# Altium schematic sheet MCU.SchDoc: C2Sv1 Schematic
size A4; Author: Felix Abbott; CompanyName: PAST; SheetNumber: 2; SheetTotal: 5
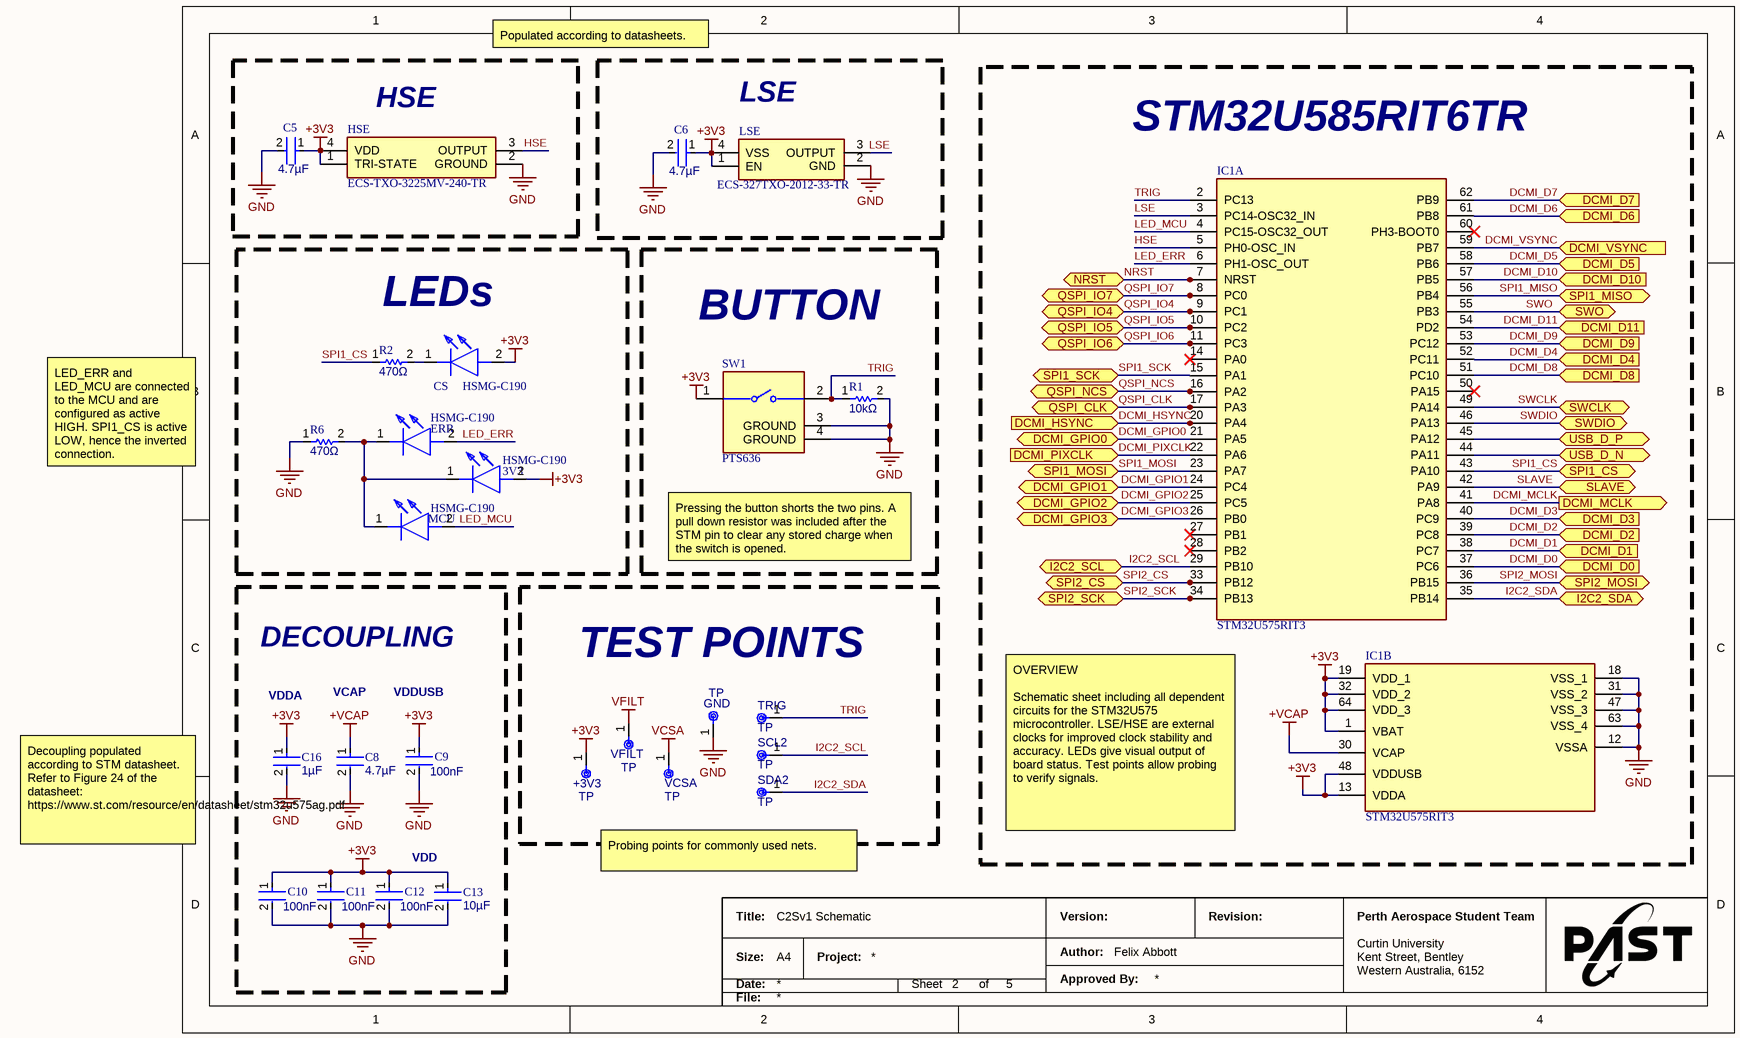
[diagram p0: MCU.SchDoc]

## Parts
3V3  HSMG-C190  [LEDC1608X90N]
+3V3  TP  [TP06R]  (no BOM)
C5  value 4.7µF  [FP-GRT188-0_2-IPC_B]  (hidden comment: GRT188C81E475KE13J)
C6  value 4.7µF  [FP-GRT188-0_2-IPC_B]  (hidden comment: GRT188C81E475KE13J)
C8  value 4.7µF  [FP-GRT188-0_2-IPC_B]  (hidden comment: GRT188C81E475KE13J)
C9  value 100nF  [FP-GCM188-0_1-IPC_B]  (hidden comment: GCM188L81H104MA57D)
C10  value 100nF  [FP-GCM188-0_1-IPC_B]  (hidden comment: GCM188L81H104MA57D)
C11  value 100nF  [FP-GCM188-0_1-IPC_B]  (hidden comment: GCM188L81H104MA57D)
C12  value 100nF  [FP-GCM188-0_1-IPC_B]  (hidden comment: GCM188L81H104MA57D)
C13  value 10µF  [FP-GCM188-0_2-IPC_B]  (hidden comment: GCM188D70J106ME36D)
C16  value 1µF  [FP-GCM188-0_1-IPC_B]  (hidden comment: GCM188R71C105KA64J)
CS  HSMG-C190  [LEDC1608X90N]
ERR  HSMG-C190  [LEDC1608X90N]
GND  TP  [TP06R]  (no BOM)
HSE  ECS-TXO-3225MV-240-TR  [ECSTXO3225MV240TR]
IC1  STM32U575RIT3  [QFP50P1200X1200X160-64N]  (parts A,B of 2)
LSE  ECS-327TXO-2012-33-TR  [ECS327TXO201233TR]
MCU  HSMG-C190  [LEDC1608X90N]
R1  value 10kΩ  [FP-CRCW0603-e3-IPC_C]  (hidden comment: CRCW060310K0FKED)
R2  value 470Ω  [FP-CRCW0603-e3-IPC_C]  (hidden comment: CRCW0603470RFKEC)
R6  value 470Ω  [FP-CRCW0603-e3-IPC_C]  (hidden comment: CRCW0603470RFKEC)
SCL2  TP  [TP06R]  (no BOM)
SDA2  TP  [TP06R]  (no BOM)
SW1  PTS636  [FP-PTS636_SKG25_SMTR_LFS-MFG]
TRIG  TP  [TP06R]  (no BOM)
VCSA  TP  [TP06R]  (no BOM)
VFILT  TP  [TP06R]  (no BOM)

## Blocks framed on the sheet
HSE: C5 HSE
LSE: C6 LSE
STM32U585RIT6TR: IC1
LEDs: 3V3 CS ERR MCU R2 R6
BUTTON: R1 SW1
DECOUPLING: C8-C13 C16
TEST POINTS: +3V3 GND SCL2 SDA2 TRIG VCSA VFILT

## Ports
DCMI_D0 (in), DCMI_D1 (in), DCMI_D2 (in), DCMI_D3 (in), DCMI_D4 (in), DCMI_D5 (in), DCMI_D6 (in), DCMI_D7 (in), DCMI_D8 (in), DCMI_D9 (in), DCMI_D10 (in), DCMI_D11 (in), DCMI_GPIO0 (bidir), DCMI_GPIO1 (bidir), DCMI_GPIO2 (bidir), DCMI_GPIO3 (bidir), DCMI_HSYNC (in), DCMI_MCLK (out), DCMI_PIXCLK (in), DCMI_VSYNC (in), I2C2_SCL (bidir), I2C2_SDA (bidir), NRST (bidir), QSPI_CLK (bidir), QSPI_IO4 (bidir), QSPI_IO5 (bidir), QSPI_IO6 (bidir), QSPI_IO7 (bidir), QSPI_NCS (bidir), SLAVE (bidir), SPI1_CS (bidir), SPI1_MISO (bidir), SPI1_MOSI (bidir), SPI1_SCK (bidir), SPI2_CS (bidir), SPI2_MOSI (bidir), SPI2_SCK (bidir), SWCLK (bidir), SWDIO (bidir), SWO (bidir), USB_D_N (bidir), USB_D_P (bidir)

## Nets
+3V3: 3V3.2(A) +3V3.1(TP) C5.1 C6.1 C9.1 C10.1 C11.1 C12.1 C13.1 C16.1 CS.2(A) HSE.1(TRI-STATE) HSE.4(VDD) IC1.1(VBAT) IC1.13(VDDA) IC1.19(VDD_1) IC1.32(VDD_2) IC1.48(VDDUSB) IC1.64(VDD_3) LSE.1(EN) LSE.4(VSS) SW1.1
+VCAP: C8.1 IC1.30(VCAP)
GND: C5.2 C6.2 C8.2 C9.2 C10.2 C11.2 C12.2 C13.2 C16.2 GND.1(TP) HSE.2(GROUND) IC1.12(VSSA) IC1.18(VSS_1) IC1.31(VSS_2) IC1.47(VSS_3) IC1.63(VSS_4) LSE.2(GND) R1.2 R6.1 SW1.3(GROUND) SW1.4(GROUND)
VCSA: VCSA.1(TP)
VFILT: VFILT.1(TP)
DCMI_D0: IC1.37(PC6) ; port DCMI_D0
DCMI_D1: IC1.38(PC7) ; port DCMI_D1
DCMI_D2: IC1.39(PC8) ; port DCMI_D2
DCMI_D3: IC1.40(PC9) ; port DCMI_D3
DCMI_D4: IC1.52(PC11) ; port DCMI_D4
DCMI_D5: IC1.58(PB6) ; port DCMI_D5
DCMI_D6: IC1.61(PB8) ; port DCMI_D6
DCMI_D7: IC1.62(PB9) ; port DCMI_D7
DCMI_D8: IC1.51(PC10) ; port DCMI_D8
DCMI_D9: IC1.53(PC12) ; port DCMI_D9
DCMI_D10: IC1.57(PB5) ; port DCMI_D10
DCMI_D11: IC1.54(PD2) ; port DCMI_D11
DCMI_GPIO0: IC1.21(PA5) ; port DCMI_GPIO0
DCMI_GPIO1: IC1.24(PC4) ; port DCMI_GPIO1
DCMI_GPIO2: IC1.25(PC5) ; port DCMI_GPIO2
DCMI_GPIO3: IC1.26(PB0) ; port DCMI_GPIO3
DCMI_HSYNC: IC1.20(PA4) ; port DCMI_HSYNC
DCMI_MCLK: IC1.41(PA8) ; port DCMI_MCLK
DCMI_PIXCLK: IC1.22(PA6) ; port DCMI_PIXCLK
DCMI_VSYNC: IC1.59(PB7) ; port DCMI_VSYNC
HSE: HSE.3(OUTPUT) IC1.5(PH0-OSC_IN)
I2C2_SCL: IC1.29(PB10) SCL2.1(TP) ; port I2C2_SCL
I2C2_SDA: IC1.35(PB14) SDA2.1(TP) ; port I2C2_SDA
LED_ERR: ERR.2(A) IC1.6(PH1-OSC_OUT)
LED_MCU: IC1.4(PC15-OSC32_OUT) MCU.2(A)
LSE: IC1.3(PC14-OSC32_IN) LSE.3(OUTPUT)
NRST: IC1.7(NRST) ; port NRST
QSPI_CLK: IC1.17(PA3) ; port QSPI_CLK
QSPI_IO4: IC1.9(PC1) ; port QSPI_IO4
QSPI_IO5: IC1.10(PC2) ; port QSPI_IO5
QSPI_IO6: IC1.11(PC3) ; port QSPI_IO6
QSPI_IO7: IC1.8(PC0) ; port QSPI_IO7
QSPI_NCS: IC1.16(PA2) ; port QSPI_NCS
SLAVE: IC1.42(PA9) ; port SLAVE
SPI1_CS: IC1.43(PA10) R2.1 ; port SPI1_CS
SPI1_MISO: IC1.56(PB4) ; port SPI1_MISO
SPI1_MOSI: IC1.23(PA7) ; port SPI1_MOSI
SPI1_SCK: IC1.15(PA1) ; port SPI1_SCK
SPI2_CS: IC1.33(PB12) ; port SPI2_CS
SPI2_MOSI: IC1.36(PB15) ; port SPI2_MOSI
SPI2_SCK: IC1.34(PB13) ; port SPI2_SCK
SWCLK: IC1.49(PA14) ; port SWCLK
SWDIO: IC1.46(PA13) ; port SWDIO
SWO: IC1.55(PB3) ; port SWO
TRIG: IC1.2(PC13) R1.1 SW1.2 TRIG.1(TP)
USB_D_N: IC1.44(PA11) ; port USB_D_N
USB_D_P: IC1.45(PA12) ; port USB_D_P
Net3V3_1: 3V3.1(K) ERR.1(K) MCU.1(K) R6.2
NetCS_1: CS.1(K) R2.2

Not connected (* = marked no-connect by the designer): IC1 14(PA0)* 27(PB1)* 28(PB2)* 50(PA15)* 60(PH3-BOOT0)*

## Notes on the sheet
- Populated according to datasheets.
- LED_ERR and LED_MCU are connected to the MCU and are configured as active HIGH. SPI1_CS is active LOW, hence the inverted connection.
- (near SW1) Pressing the button shorts the two pins. A pull down resistor was included after the STM pin to clear any stored charge when the switch is opened.
- VDDA
- VCAP
- VDDUSB
- Decoupling populated according to STM datasheet. Refer to Figure 24 of the datasheet: https://www.st.com/resource/en/datasheet/stm32u575ag.pdf
- VDD
- OVERVIEW
  Schematic sheet including all dependent circuits for the STM32U575 microcontroller. LSE/HSE are external clocks for improved clock stability and accuracy. LEDs give visual output of board status. Test points allow probing to verify signals.
- (near SDA2) Probing points for commonly used nets.
- Title:
- Version:
- Revision:
- Perth Aerospace Student Team
- Size:
- Date:
- A4
- Project:
- Sheet
- of
- Author:
- Approved By:
- Curtin University
- Kent Street, Bentley
- Western Australia, 6152
- File:

## Library data of the parts
3V3 CS ERR MCU = CMP-062-000014-1: LED; Manufacturer_Name: Avago Technologies; Mouser Part Number: 630-HSMG-C190; Manufacturer_Part_Number: HSMG-C190; Mouser Price/Stock: https://www.mouser.co.uk/ProductDetail/Broadcom-Avago/HSMG-C190?qs=YDL0qNrpDT605sxOaps8VQ%3D%3D; Datasheet Link: https://docs.broadcom.com/docs/AV02-0551EN; Source: SamacSys.SchLib; Design Item ID: HSMG-C190; Height: 0.9mm
+3V3 GND SCL2 SDA2 TRIG VCSA VFILT = CMP-00028-00007-4: test point; Pins: 1; Author: Raphael Ho
C5 C6 C8 = CMP-001-00100-1: Ceramic Capacitor, Multilayer, Ceramic, 25V, 10% +Tol, 10% -Tol, X6S, 22% TC, 4.7uF, Surface Mount, 1608M/0603; Manufacturer Lifecycle Status: IN PRODUCTION; Added By: Felix; Width: 800µm; Material: Ceramic; Number of Terminals: 2; Introduction Date: 2016-01-27; Max Operating Temperature: 105°C; Export Control Classification Number (ECCN) Code: EAR99; Dielectric Material: Ceramic; REACH SVHC: Yes; Case/Package: 0603; Harmonized Tariff Schedule (HTS) Code: 8532.24.00.20; Min Operating Temperature: -55°C; Height: 800µm; RoHS: Compliant; Mounting Technology: Surface Mount; Voltage Rating: 25V; Thickness: 800µm; Tolerance: 10%; Lifecycle Status: Production; Voltage Rating (DC): 25V; Length: 1.6mm
C9-C12 = CMP-001-00108-1: Cap Ceramic 0.1uF 50V X8L 20% Pad SMD 0603 150C Automotive T/R; Manufacturer Lifecycle Status: IN PRODUCTION; Added By: Felix; Country of Origin: Philippines; Number of Terminals: 2; Max Operating Temperature: 150°C; Tolerance: 20%; Harmonized Tariff Schedule (HTS) Code: 8532.24.00.20; Length: 1.6mm; Thickness: 800µm; Export Control Classification Number (ECCN) Code: EAR99; Voltage Rating (DC): 50V; Mounting Technology: Surface Mount; Dielectric Material: Ceramic; Height: 800µm; Lifecycle Status: Production; Material: Ceramic; Introduction Date: 2013-11-20; Voltage Rating: 50V; Width: 800µm; RoHS: Compliant; REACH SVHC: Yes; Min Operating Temperature: -55°C; Case/Package: 0603
C13 = CMP-001-00109-1: 6.3V 10uF X7T ±20% 0603 Multilayer Ceramic Capacitors MLCC - SMD/SMT ROHS; Manufacturer Lifecycle Status: IN PRODUCTION; Added By: Felix; Thickness: 800µm; REACH SVHC: Yes; Voltage Rating (DC): 6.3V; Number of Terminals: 2; Dielectric Material: Ceramic; Lifecycle Status: Production; Harmonized Tariff Schedule (HTS) Code: 8532.24.00.20; Case/Package: 0603; Introduction Date: 2020-01-27; Schedule B: 8532240020; Mounting Technology: Surface Mount; Voltage Rating: 6.3V; Export Control Classification Number (ECCN) Code: EAR99; Min Operating Temperature: -55°C; RoHS: Compliant; Material: Ceramic; Width: 800µm; Max Operating Temperature: 125°C; Height: 800µm; Length: 1.6mm; Tolerance: 20%
C16 = CMP-001-00107-1: 16V 1uF X7R ±10% 0603 Multilayer Ceramic Capacitors MLCC - SMD/SMT ROHS; Manufacturer Lifecycle Status: IN PRODUCTION; Added By: Felix; Tolerance: 10%; Max Operating Temperature: 125°C; Case Code (Imperial): 0603; Height: 800µm; Export Control Classification Number (ECCN) Code: EAR99; Voltage Rating (DC): 16V; Depth: 800µm; Case/Package: 0603; Case Code (Metric): 1608; Ratings: AEC-Q200; Mounting Technology: Surface Mount; Lifecycle Status: Production; RoHS: Compliant; Length: 1.6mm; Introduction Date: 2010-10-29; Radiation Hardening: No; Min Operating Temperature: -55°C; Packaging: Tape & Reel (TR); Lead Free: Lead Free; Voltage Rating: 16V; Material: Ceramic; Country of Origin: Philippines; Dielectric Material: Ceramic; REACH SVHC: Yes; Width: 800µm; Harmonized Tariff Schedule (HTS) Code: 8532.24.00.20; Number of Terminals: 2; Schedule B: 8532240020, 8532240020; Dielectric: X7R
HSE = CMP-179-000000-2: Crystal or Oscillator; Manufacturer_Name: ECS; Source: C2Sv0.1.SchLib; Mouser Price/Stock: https://www.mouser.co.uk/ProductDetail/ECS/ECS-TXO-3225MV-240-TR?qs=d0WKAl%252BL4KYXn7UuwSFJGQ%3D%3D; Height: 1.2mm; Datasheet Link: https://eu.mouser.com/datasheet/2/122/ECS-TXO-3225MV-1634330.pdf; Mouser Part Number: 520-TXO-3225MV-240-T; Design Item ID: ECS-TXO-3225MV-240-TR; Manufacturer_Part_Number: ECS-TXO-3225MV-240-TR; Imported By: Felix
IC1 = CMP-209-000002-2: Ultra-low-power Arm Cortex-M33 32-bit MCU+TrustZone+FPU; Manufacturer_Name: STMicroelectronics; Added By: Felix Abbott; Manufacturer_Part_Number: STM32U575RIT3; Source: Schlib1.SchLib; Height: 1.6mm; Datasheet Link: https://www.st.com/resource/en/datasheet/stm32u575ag.pdf; Design Item ID: STM32U575RIT3
LSE = CMP-190-000000-2: Crystal or Oscillator; Manufacturer_Name: ECS; Added By: Felix; Mouser Price/Stock: https://www.mouser.co.uk/ProductDetail/ECS/ECS-327TXO-2012-33-TR?qs=amGC7iS6iy%252Bnhf6zW2Y7hQ%3D%3D; Height: 1.2mm; Datasheet Link: https://ecsxtal.com/store/pdf/ECS-327TXO-2012.pdf; Manufacturer_Part_Number: ECS-327TXO-2012-33-TR; Mouser Part Number: 520-327TXO-2012-33TR; Source: Schematic Library.SchLib; Design Item ID: ECS-327TXO-2012-33-TR
R1 = CMP-009-00205-3: Resistor; Temperature Coefficient: 100ppm/°C; Working Voltage: 75V; Power Dissipation: 100mW; Added By: Felix; Tolerance: 1%; Max Operating Temperature: 155°C; Width: 850µm; Composition: Thick Film; Mounting Technology: Surface Mount; Number of Terminations: 2; Height: 450µm; Number of Terminals: 2; RoHS: Compliant; Power Rating: 100mW; Harmonized Tariff Schedule (HTS) Code: 8533.21.00.30; Case/Package: 0603; Export Control Classification Number (ECCN) Code: EAR99; Introduction Date: 2003-05-01; REACH SVHC: Yes; Lead Free: Lead Free; Features: Automotive AEC-Q200; Min Operating Temperature: -55°C; Voltage Rating: 75V; Country of Origin: Israel, Taiwan; Lifecycle Status: Production; Max Power Dissipation: 100mW; Length: 1.55mm; Packaging: Tape & Reel (TR); China RoHS: Non-Compliant
R2 R6 = CMP-009-00206-1: Resistor; Power Dissipation: 100mW; Voltage Rating: 75V; Tolerance: 1%; Added By: Felix; Temperature Coefficient: 100ppm/°C; China RoHS: Non-Compliant; Mounting Technology: Surface Mount; Export Control Classification Number (ECCN) Code: EAR99; Depth: 850µm; Number of Terminals: 2; REACH SVHC: Yes; Case/Package: 0603; Harmonized Tariff Schedule (HTS) Code: 8533.21.00.30; Lifecycle Status: Production; Max Operating Temperature: 155°C; Length: 1.55mm; Lead Free: Lead Free; Max Power Dissipation: 100mW; RoHS: Compliant; Height: 450µm; Min Operating Temperature: -55°C; Width: 850µm; Country of Origin: Israel, Taiwan; Composition: Thick Film; Military Standard: Not; Number of Terminations: 2; Features: Automotive AEC-Q200; Packaging: Tape & Reel (TR); Power Rating: 100mW; Introduction Date: 2005-02-16; Working Voltage: 75V
SW1 = CMP-011-00018-1: Tactile Switch; Contact Resistance: 100mΩ; Throw Configuration: SPST; Max Voltage Rating (DC): 12V; Electrical Life: 100kcycles; Max Current Rating: 50mA; Added by: Felix A; Number of Positions: 1; Operating Force: 2.94N; Sealable: IP40; Insulation Resistance: 100MΩ; Color: White; Max Operating Temperature: 90°C; Min Operating Temperature: -40°C; RoHS: Compliant; Mouser Link: https://au.mouser.com/c/electromechanical/switches/tactile-switches/?illuminated=Non-Illuminated&mounting%20direction=Straight&mounting%20style=SMD%2FSMT&series=PTS636&switch%20function=OFF%20-%20%28ON%29&termination%20style=SMD%2FSMT&instock=y; Height: 1.9mm; Contact Current Rating: 50mA; Life (Cycles): 100kcycles; Voltage Rating (DC): 12V; Lifecycle Status: Production; Schedule B: 8536509065; Mounting Technology: Surface Mount; Length: 6.1mm; REACH SVHC: Yes